# Altium schematic sheet Microcontroller.SchDoc
size 420 x 297 mm; DocumentNumber: Microcontroller
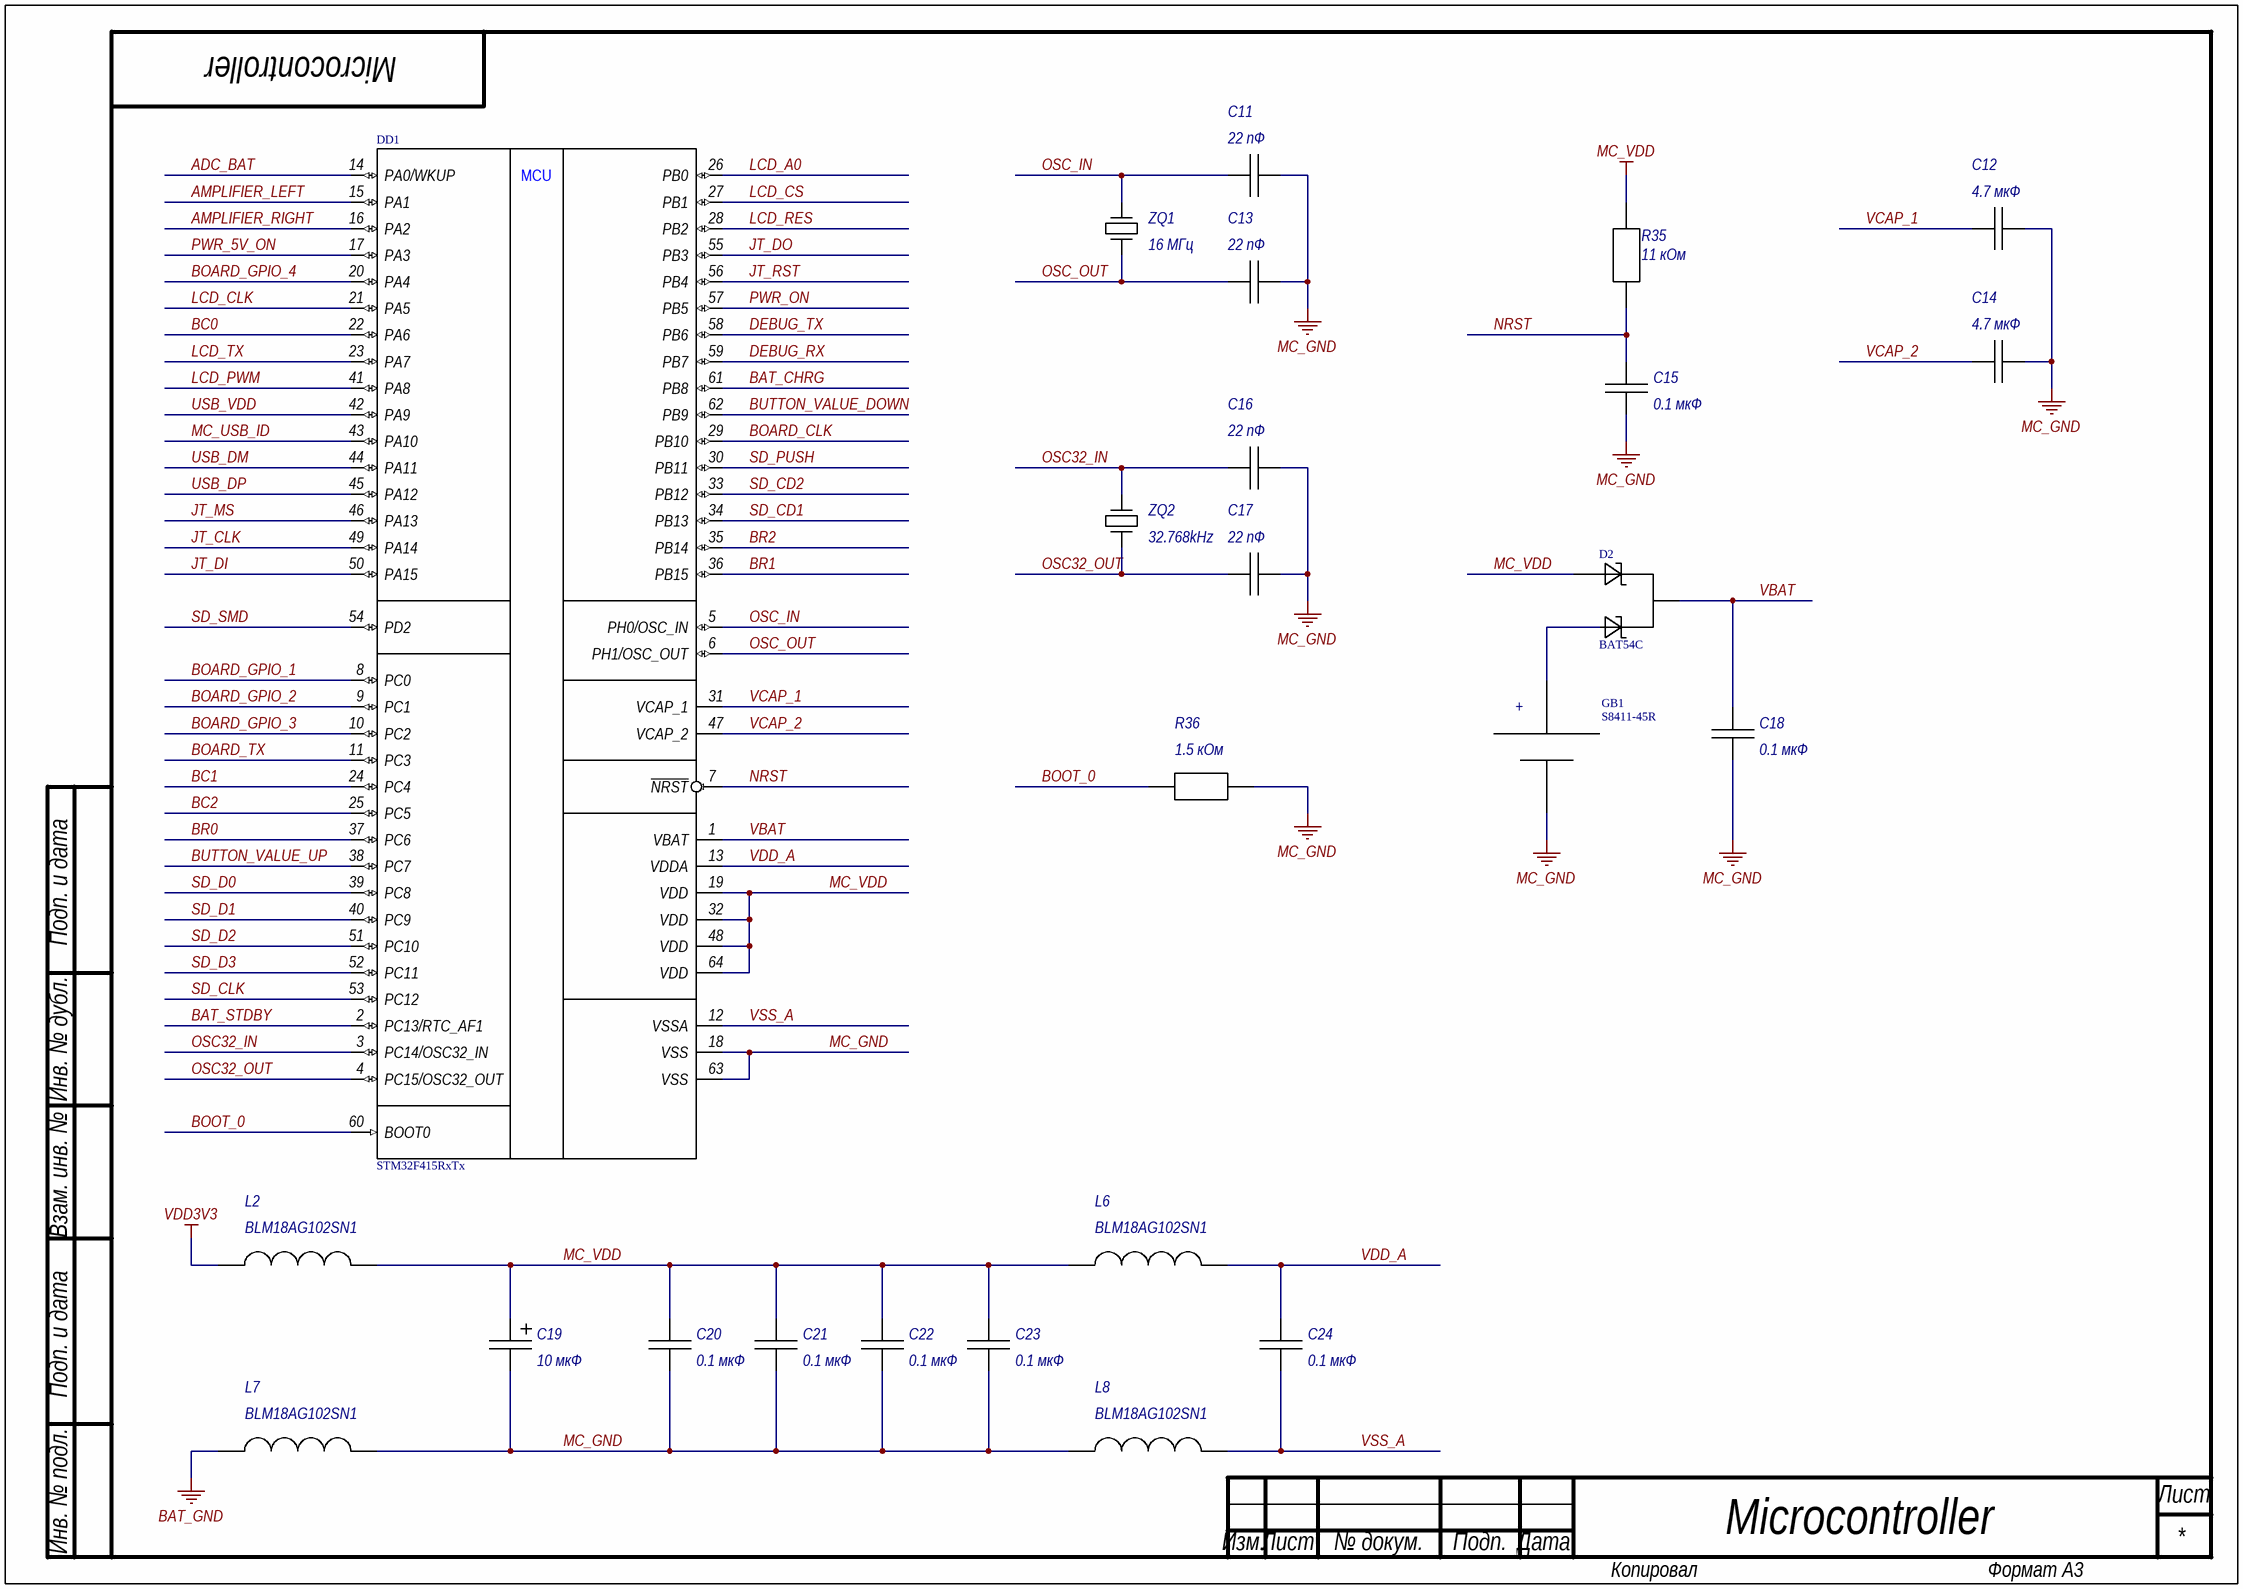
[diagram p0: Microcontroller.SchDoc]

## Parts
C11  22 пФ  [C 0805]
C12  4.7 мкФ  [C 0805]
C13  22 пФ  [C 0805]
C14  4.7 мкФ  [C 0805]
C15  0.1 мкФ  [C 0805]
C16  22 пФ  [C 0805]
C17  22 пФ  [C 0805]
C18  0.1 мкФ  [C 0805]
C19  10 мкФ  [C TAN_A]
C20  0.1 мкФ  [C 0805]
C21  0.1 мкФ  [C 0805]
C22  0.1 мкФ  [C 0805]
C23  0.1 мкФ  [C 0805]
C24  0.1 мкФ  [C 0805]
D2  BAT54C  [SOT-23]
DD1  STM32F415RxTx  [LQFP64]
GB1  S8411-45R  [S8411-45R]
L2  BLM18AG102SN1  [FB 0603]
L6  BLM18AG102SN1  [FB 0603]
L7  BLM18AG102SN1  [FB 0603]
L8  BLM18AG102SN1  [FB 0603]
R35  11 кОм  [RES 0402]
R36  1.5 кОм  [RES 0402]
ZQ1  value 16 МГц  [NX3225SA]  (hidden comment: NX3225SA-16.000M-STD-CRS-2)
ZQ2  value 32.768kHz  [MC-306]  (hidden comment: MC-306)

## Nets
BAT_GND: L7.1
MC_GND: C11.2 C12.2 C13.2 C14.2 C15.1 C16.2 C17.2 C18.2 C19.2 C20.2 C21.2 C22.2 C23.2 DD1.18(VSS) DD1.63(VSS) GB1.2 L7.2 L8.1 R36.1
MC_VDD: C19.1 C20.1 C21.1 C22.1 C23.1 D2.2 DD1.19(VDD) DD1.32(VDD) DD1.48(VDD) DD1.64(VDD) L2.2 L6.1 R35.1
VDD3V3: L2.1
ADC_BAT: DD1.14(PA0/WKUP)
AMPLIFIER_LEFT: DD1.15(PA1)
AMPLIFIER_RIGHT: DD1.16(PA2)
BAT_CHRG: DD1.61(PB8)
BAT_STDBY: DD1.2(PC13/RTC_AF1)
BC0: DD1.22(PA6)
BC1: DD1.24(PC4)
BC2: DD1.25(PC5)
BOARD_CLK: DD1.29(PB10)
BOARD_GPIO_1: DD1.8(PC0)
BOARD_GPIO_2: DD1.9(PC1)
BOARD_GPIO_3: DD1.10(PC2)
BOARD_GPIO_4: DD1.20(PA4)
BOARD_TX: DD1.11(PC3)
BOOT_0: DD1.60(BOOT0) R36.2
BR0: DD1.37(PC6)
BR1: DD1.36(PB15)
BR2: DD1.35(PB14)
BUTTON_VALUE_DOWN: DD1.62(PB9)
BUTTON_VALUE_UP: DD1.38(PC7)
DEBUG_RX: DD1.59(PB7)
DEBUG_TX: DD1.58(PB6)
JT_CLK: DD1.49(PA14)
JT_DI: DD1.50(PA15)
JT_DO: DD1.55(PB3)
JT_MS: DD1.46(PA13)
JT_RST: DD1.56(PB4)
LCD_A0: DD1.26(PB0)
LCD_CLK: DD1.21(PA5)
LCD_CS: DD1.27(PB1)
LCD_PWM: DD1.41(PA8)
LCD_RES: DD1.28(PB2)
LCD_TX: DD1.23(PA7)
MC_USB_ID: DD1.43(PA10)
NRST: C15.2 DD1.7(~{NRST}) R35.2
OSC32_IN: C16.1 DD1.3(PC14/OSC32_IN) ZQ2.4(NC)
OSC32_OUT: C17.1 DD1.4(PC15/OSC32_OUT) ZQ2.1(XI)
OSC_IN: C11.1 DD1.5(PH0/OSC_IN) ZQ1.3(XO)
OSC_OUT: C13.1 DD1.6(PH1/OSC_OUT) ZQ1.1(XI)
PWR_5V_ON: DD1.17(PA3)
PWR_ON: DD1.57(PB5)
SD_CD1: DD1.34(PB13)
SD_CD2: DD1.33(PB12)
SD_CLK: DD1.53(PC12)
SD_D0: DD1.39(PC8)
SD_D1: DD1.40(PC9)
SD_D2: DD1.51(PC10)
SD_D3: DD1.52(PC11)
SD_PUSH: DD1.30(PB11)
SD_SMD: DD1.54(PD2)
USB_DM: DD1.44(PA11)
USB_DP: DD1.45(PA12)
USB_VDD: DD1.42(PA9)
VBAT: C18.1 D2.3 DD1.1(VBAT)
VCAP_1: C12.1 DD1.31(VCAP_1)
VCAP_2: C14.1 DD1.47(VCAP_2)
VDD_A: C24.1 DD1.13(VDDA) L6.2
VSS_A: C24.2 DD1.12(VSSA) L8.2
NetD2_1: D2.1 GB1.1

Not connected (* = marked no-connect by the designer): ZQ1 2(NC) 4(NC); ZQ2 2(NC)

## Notes on the sheet
- Подп. и дата
- Инв. № дубл.
- Взам. инв. №
- Инв. № подл.
- Лист
- Изм.
- № докум.
- Подп.
- Дата
- Копировал
- Формат А3
- (in symbol S8411-45R) +
- (in symbol STM32F415RxTx) MCU

## Library data of the parts
C11-C18 C20-C24 = CAP 0805: SMD Capacitor 0805; Manufacturer: /Укажите компанию-производителя/; Tolerance: /Укажите допуск в процентах/; Temperature coefficient: /Формат: ±? ppm/°C/; Type: Конденсатор керамический; TC: /Укажите тип диэлектрика/; Size: 0805; Temperature range: /Формат: -? ... ? °C/
C19 = CAP TAN_A: SMD Tantalium Capacitor A; Type: Конденсатор танталовый; Rated voltage: 16; Size: A
R35 R36 = RES 0402
ZQ1 = NX3225SA-16.000M-STD-CRS-2: QUARTZ CRYSTAL; Manufacturer: NDK; Load capacitance: 8 пФ; Frequency stability: ±15 ppm; Type: Кварцевый резонатор; Temperature range: -40 ... 125 °C
ZQ2 = MC-306: QUARTZ CRYSTAL; Type: Кварцевый резонатор